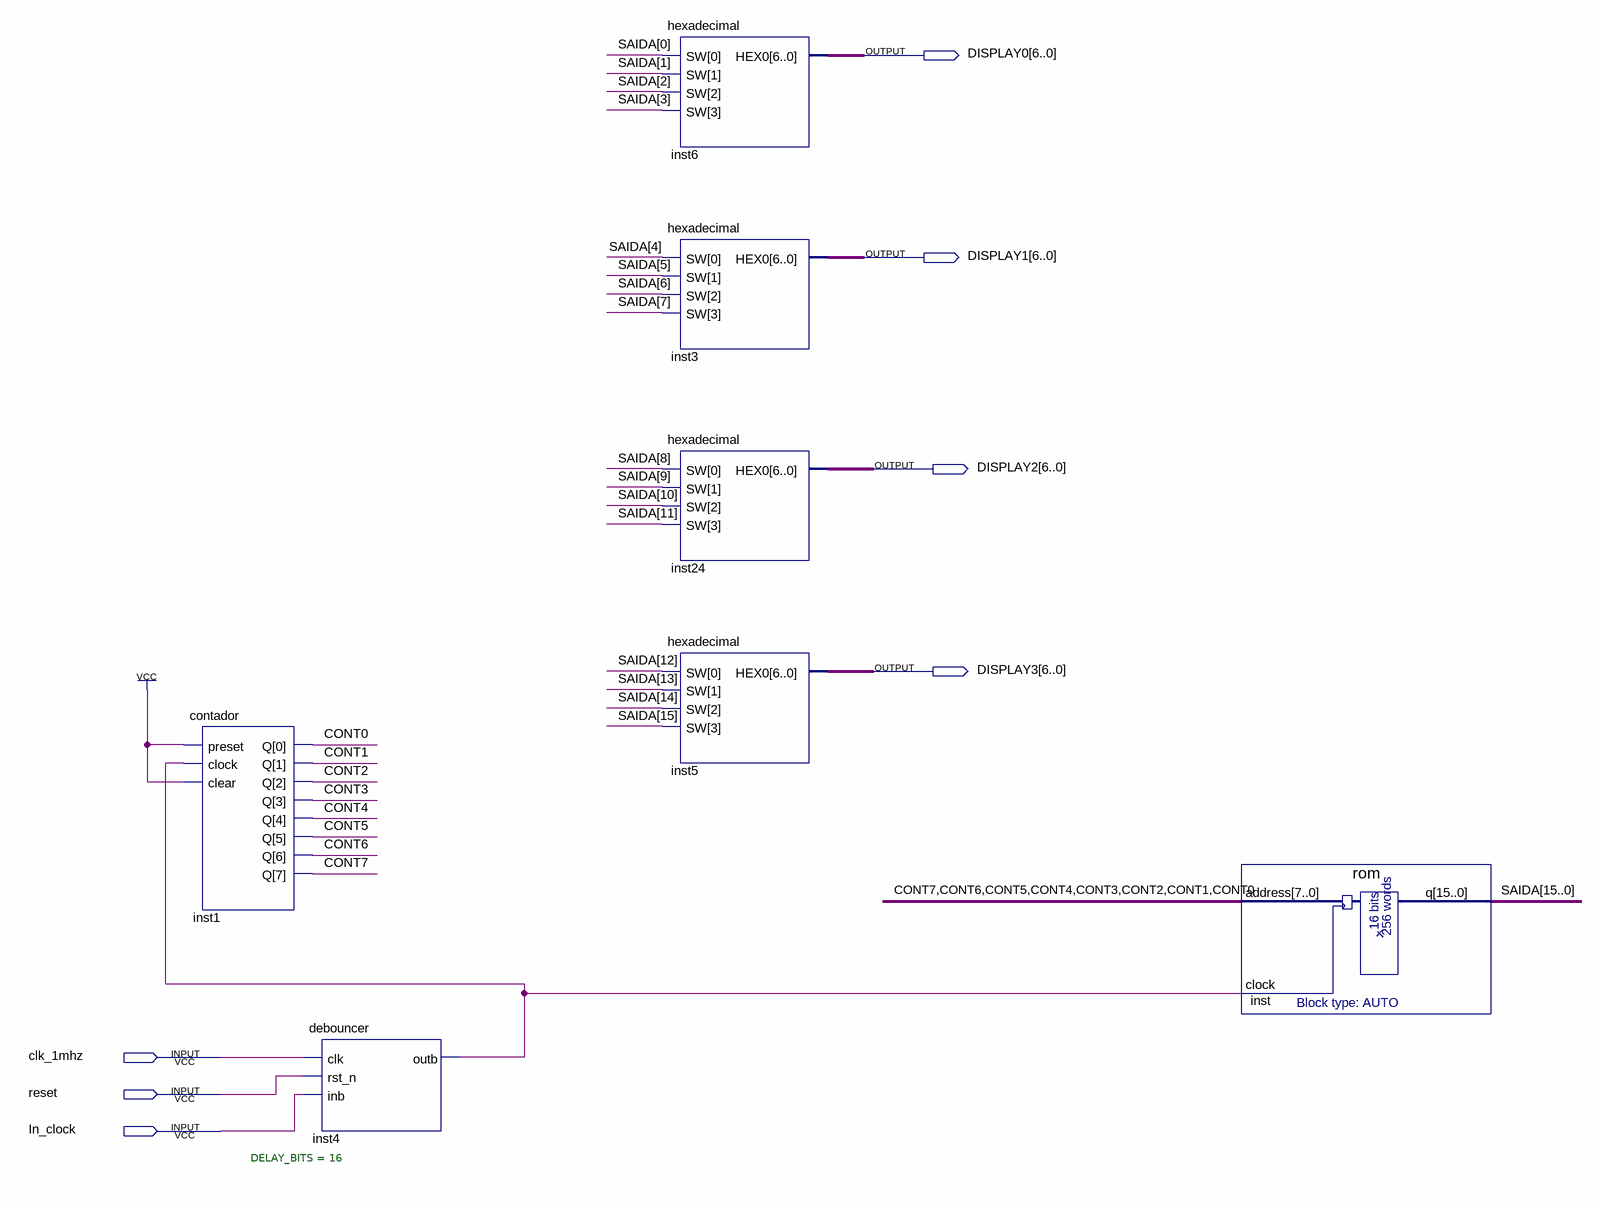
[diagram p0: schematic sheet]
// Quartus schematic teste_memoria.bdf as structural Verilog: 7 symbols, 7 pins
module teste_memoria (
  input  clk_1mhz,
  input  reset,
  input  In_clock,
  output [6:0] DISPLAY0,
  output [6:0] DISPLAY1,
  output [6:0] DISPLAY2,
  output [6:0] DISPLAY3
);

  wire CONT0, CONT1, CONT2, CONT3, CONT4, CONT5, CONT6, CONT7, inst4_outb;
  wire [15:0] SAIDA;

  contador inst1 (
    .preset(1'b1), .clock(inst4_outb), .clear(1'b1),
    .Q({CONT7, CONT6, CONT5, CONT4, CONT3, CONT2, CONT1, CONT0}));
  debouncer #(.DELAY_BITS(16)) inst4 (.clk(clk_1mhz), .rst_n(reset), .inb(In_clock), .outb(inst4_outb));
  hexadecimal inst6 (.SW(SAIDA[3:0]), .HEX0(DISPLAY0));
  hexadecimal inst3 (.SW(SAIDA[7:4]), .HEX0(DISPLAY1));
  hexadecimal inst24 (.SW(SAIDA[11:8]), .HEX0(DISPLAY2));
  hexadecimal inst5 (.SW(SAIDA[15:12]), .HEX0(DISPLAY3));
  rom inst (.address({CONT7, CONT6, CONT5, CONT4, CONT3, CONT2, CONT1, CONT0}), .clock(inst4_outb), .q(SAIDA));
endmodule
